# Altium schematic sheet bmsMaster_main.SchDoc
size C; SheetNumber: 1; SheetTotal: 1
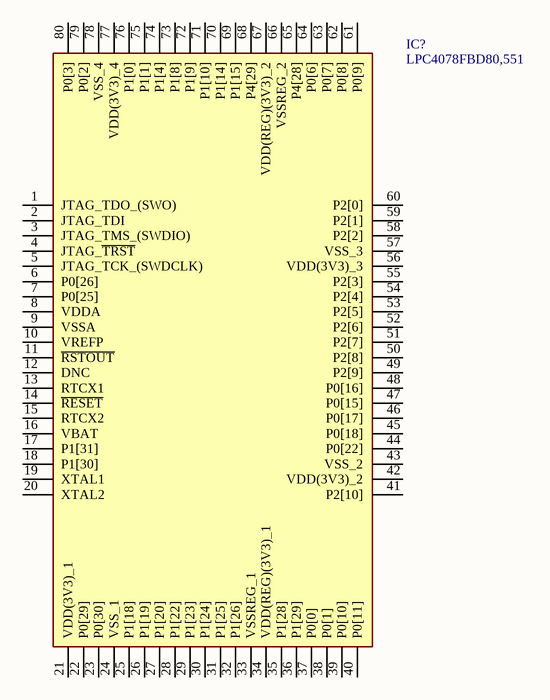
[diagram p0: bmsMaster_main.SchDoc]

## Parts
IC?  LPC4078FBD80,551  [QFP50P1400X1400X160-80N]

## Nets

Not connected (* = marked no-connect by the designer): IC? 1(JTAG_TDO_(SWO)) 2(JTAG_TDI) 3(JTAG_TMS_(SWDIO)) 4(JTAG_~{TRST}) 5(JTAG_TCK_(SWDCLK)) 6(P0[26]) 7(P0[25]) 8(VDDA) 9(VSSA) 10(VREFP) 11(~{RSTOUT}) 12(DNC) 13(RTCX1) 14(~{RESET}) 15(RTCX2) 16(VBAT) 17(P1[31]) 18(P1[30]) 19(XTAL1) 20(XTAL2) 21(VDD(3V3)_1) 22(P0[29]) 23(P0[30]) 24(VSS_1) 25(P1[18]) 26(P1[19]) 27(P1[20]) 28(P1[22]) 29(P1[23]) 30(P1[24]) 31(P1[25]) 32(P1[26]) 33(VSSREG_1) 34(VDD(REG)(3V3)_1) 35(P1[28]) 36(P1[29]) 37(P0[0]) 38(P0[1]) 39(P0[10]) 40(P0[11]) 41(P2[10]) 42(VDD(3V3)_2) 43(VSS_2) 44(P0[22]) 45(P0[18]) 46(P0[17]) 47(P0[15]) 48(P0[16]) 49(P2[9]) 50(P2[8]) 51(P2[7]) 52(P2[6]) 53(P2[5]) 54(P2[4]) 55(P2[3]) 56(VDD(3V3)_3) 57(VSS_3) 58(P2[2]) 59(P2[1]) 60(P2[0]) 61(P0[9]) 62(P0[8]) 63(P0[7]) 64(P0[6]) 65(P4[28]) 66(VSSREG_2) 67(VDD(REG)(3V3)_2) 68(P4[29]) 69(P1[15]) 70(P1[14]) 71(P1[10]) 72(P1[9]) 73(P1[8]) 74(P1[4]) 75(P1[1]) 76(P1[0]) 77(VDD(3V3)_4) 78(VSS_4) 79(P0[2]) 80(P0[3])

## Library data of the parts
IC? = LPC4078FBD80,551: Integrated Circuit; Manufacturer_Name: NXP; Datasheet Link: http://www.nxp.com/docs/en/data-sheet/LPC408X_7X.pdf; Height: 1.6mm; Manufacturer_Part_Number: LPC4078FBD80,551; Mouser Part Number: 771-LPC4078FBD80551; Mouser Price/Stock: https://www.mouser.co.uk/ProductDetail/NXP-Semiconductors/LPC4078FBD80551?qs=vnbNJPHmPnPMtBCcoSguaA%3D%3D; Arrow Part Number: LPC4078FBD80,551; Arrow Price/Stock: https://www.arrow.com/en/products/lpc4078fbd80551/nxp-semiconductors